# Altium schematic sheet FPGA_SDRAM.SchDoc
size 420 x 297 mm; EDA_Number: ARTIQ; CompanyName: WUT ISE; Organization: WUT ISE; DocumentNumber: 14; SheetNumber: 5; ModifiedBy: -; Title2: FPGA SDRAM; ModifiedDate: -
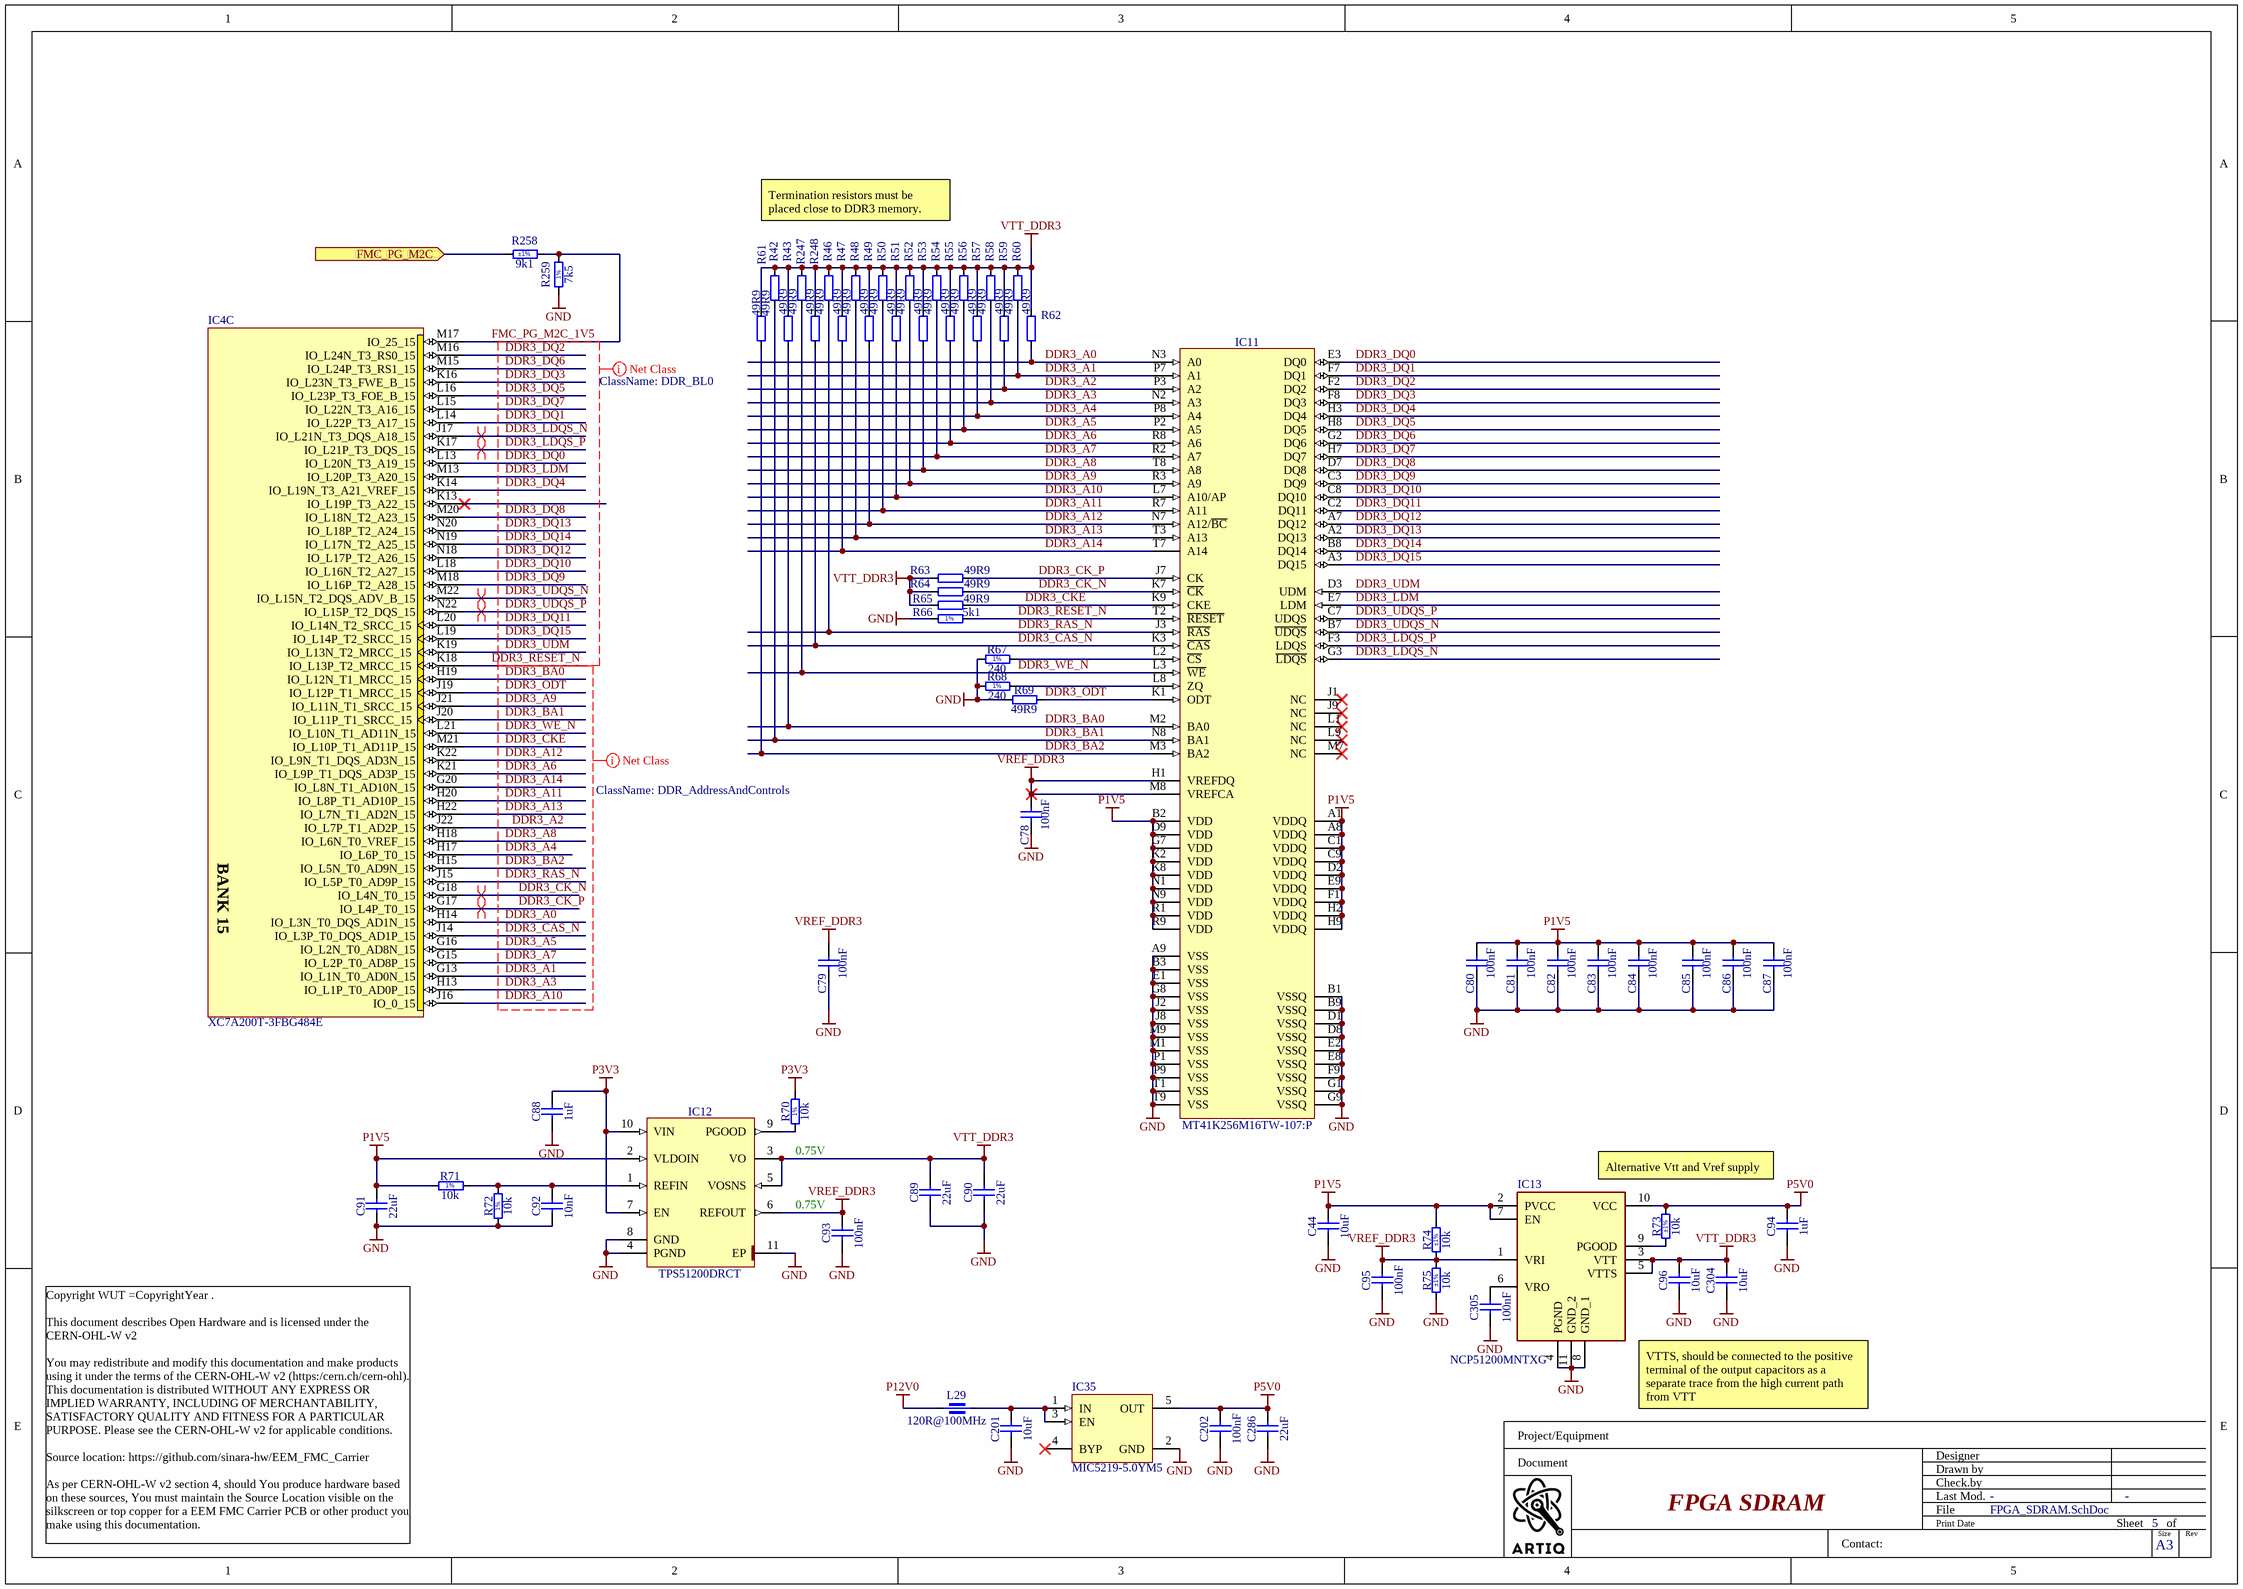
[diagram p0: FPGA_SDRAM.SchDoc]

## Parts
C44  10uF  [CAPC2012X95N]
C78  100nF  [CAPC0603X33N]
C79  100nF  [CAPC0603X33N]
C80  100nF  [CAPC0603X33N]
C81  100nF  [CAPC0603X33N]
C82  100nF  [CAPC0603X33N]
C83  100nF  [CAPC0603X33N]
C84  100nF  [CAPC0603X33N]
C85  100nF  [CAPC0603X33N]
C86  100nF  [CAPC0603X33N]
C87  100nF  [CAPC0603X33N]
C88  1uF  [CAPC1005X55N]
C89  22uF  [CAPC1608X90N]
C90  22uF  [CAPC1608X90N]
C91  22uF  [CAPC1608X90N]
C92  10nF  [CAPC1005X55N]
C93  100nF  [CAPC0603X33N]
C94  1uF  [CAPC1608X87N]
C95  100nF  [CAPC0603X33N]
C96  10uF  [CAPC2012X95N]
C201  10uF  [CAPC2012X95N]
C202  100nF  [CAPC0603X33N]
C286  22uF  [CAPC1608X90N]
C304  10uF  [CAPC2012X95N]
C305  100nF  [CAPC0603X33N]
IC4  XC7A200T-3FBG484E  [BGA484C100P22X22_2300X2300X254]  (part C of 10)
IC11  MT41K256M16TW-107:P  [BGA96C80P9X16_800X1400X120]
IC12  TPS51200DRCT  [TEXAS_DRC (S-PVSON-N10)]
IC13  NCP51200MNTXG  [SON50P300X300X100-11N]
IC35  MIC5219-5.0YM5  [SOT95P280X145-5N]
L29  120R@100MHz  [INDC1608X65N]
R42  49R9  [RESC1005X40N]
R43  49R9  [RESC1005X40N]
R46  49R9  [RESC1005X40N]
R47  49R9  [RESC1005X40N]
R48  49R9  [RESC1005X40N]
R49  49R9  [RESC1005X40N]
R50  49R9  [RESC1005X40N]
R51  49R9  [RESC1005X40N]
R52  49R9  [RESC1005X40N]
R53  49R9  [RESC1005X40N]
R54  49R9  [RESC1005X40N]
R55  49R9  [RESC1005X40N]
R56  49R9  [RESC1005X40N]
R57  49R9  [RESC1005X40N]
R58  49R9  [RESC1005X40N]
R59  49R9  [RESC1005X40N]
R60  49R9  [RESC1005X40N]
R61  49R9  [RESC1005X40N]
R62  49R9  [RESC1005X40N]
R63  49R9  [RESC1005X40N]
R64  49R9  [RESC1005X40N]
R65  49R9  [RESC1005X40N]
R66  5k1  [RESC1005X40N]
R67  240  [RESC1005X40N]
R68  240  [RESC1005X40N]
R69  49R9  [RESC1005X40N]
R70  10k  [RESC1005X40N]
R71  10k  [RESC1005X40N]
R72  10k  [RESC1005X40N]
R73  10k  Tolerance: ±1%  [RESC1005X40N]
R74  10k  Tolerance: ±1%  [RESC1005X40N]
R75  10k  Tolerance: ±1%  [RESC1005X40N]
R247  49R9  [RESC1005X40N]
R248  49R9  [RESC1005X40N]
R258  9k1  Tolerance: ±1%  [RESC1005X40N]
R259  7k5  [RESC1005X40N]

## Ports
FMC_PG_M2C (in)

## Nets
GND: C44.1 C78.1 C79.1 C80.1 C81.1 C82.1 C83.1 C84.1 C85.1 C86.1 C87.1 C88.1 C89.1 C90.1 C91.1 C92.1 C93.1 C94.1 C95.1 C96.1 C201.1 C202.1 C286.1 C304.1 C305.1 IC11.A9(VSS) IC11.B1(VSSQ) IC11.B3(VSS) IC11.B9(VSSQ) IC11.D1(VSSQ) IC11.D8(VSSQ) IC11.E1(VSS) IC11.E2(VSSQ) IC11.E8(VSSQ) IC11.F9(VSSQ) IC11.G1(VSSQ) IC11.G8(VSS) IC11.G9(VSSQ) IC11.J2(VSS) IC11.J8(VSS) IC11.M1(VSS) IC11.M9(VSS) IC11.P1(VSS) IC11.P9(VSS) IC11.T1(VSS) IC11.T9(VSS) IC12.4(PGND) IC12.8(GND) IC12.11(EP) IC13.4(PGND) IC13.8(GND_1) IC13.11(GND_2) IC35.2(GND) R66.1 R67.1 R68.1 R69.1 R72.1 R75.1 R259.1
P1V5: C44.2 C80.2 C81.2 C82.2 C83.2 C84.2 C85.2 C86.2 C87.2 C91.2 IC11.A1(VDDQ) IC11.A8(VDDQ) IC11.B2(VDD) IC11.C1(VDDQ) IC11.C9(VDDQ) IC11.D2(VDDQ) IC11.D9(VDD) IC11.E9(VDDQ) IC11.F1(VDDQ) IC11.G7(VDD) IC11.H2(VDDQ) IC11.H9(VDDQ) IC11.K2(VDD) IC11.K8(VDD) IC11.N1(VDD) IC11.N9(VDD) IC11.R1(VDD) IC11.R9(VDD) IC12.2(VLDOIN) IC13.2(PVCC) IC13.7(EN) R71.1 R74.2
P3V3: C88.2 IC12.7(EN) IC12.10(VIN) R70.2
P5V0: C94.2 C202.2 C286.2 IC13.10(VCC) IC35.5(OUT) R73.2
P12V0: L29.1
VREF_DDR3: C78.2 C79.2 C93.2 C95.2 IC11.H1(VREFDQ) IC11.M8(VREFCA) IC12.6(REFOUT) IC13.1(VRI) R74.1 R75.2
VTT_DDR3: C89.2 C90.2 C96.2 C304.2 IC12.3(VO) IC12.5(VOSNS) IC13.3(VTT) IC13.5(VTTS) R42.2 R43.2 R46.2 R47.2 R48.2 R49.2 R50.2 R51.2 R52.2 R53.2 R54.2 R55.2 R56.2 R57.2 R58.2 R59.2 R60.2 R61.2 R62.2 R63.1 R64.1 R65.1 R247.2 R248.2
DDR3_A0: IC4.H14(IO_L3N_T0_DQS_AD1N_15) IC11.N3(A0) R62.1
DDR3_A1: IC4.G13(IO_L1N_T0_AD0N_15) IC11.P7(A1) R60.1
DDR3_A2: IC4.J22(IO_L7P_T1_AD2P_15) IC11.P3(A2) R59.1
DDR3_A3: IC4.H13(IO_L1P_T0_AD0P_15) IC11.N2(A3) R58.1
DDR3_A4: IC4.H17(IO_L6P_T0_15) IC11.P8(A4) R57.1
DDR3_A5: IC4.G16(IO_L2N_T0_AD8N_15) IC11.P2(A5) R56.1
DDR3_A6: IC4.K21(IO_L9P_T1_DQS_AD3P_15) IC11.R8(A6) R55.1
DDR3_A7: IC4.G15(IO_L2P_T0_AD8P_15) IC11.R2(A7) R54.1
DDR3_A8: IC4.H18(IO_L6N_T0_VREF_15) IC11.T8(A8) R53.1
DDR3_A9: IC4.J21(IO_L11N_T1_SRCC_15) IC11.R3(A9) R52.1
DDR3_A10: IC4.J16(IO_0_15) IC11.L7(A10/AP) R51.1
DDR3_A11: IC4.H20(IO_L8P_T1_AD10P_15) IC11.R7(A11) R50.1
DDR3_A12: IC4.K22(IO_L9N_T1_DQS_AD3N_15) IC11.N7(A12/~{BC}) R49.1
DDR3_A13: IC4.H22(IO_L7N_T1_AD2N_15) IC11.T3(A13) R48.1
DDR3_A14: IC4.G20(IO_L8N_T1_AD10N_15) IC11.T7(A14) R47.1
DDR3_BA0: IC4.H19(IO_L12N_T1_MRCC_15) IC11.M2(BA0) R43.1
DDR3_BA1: IC4.J20(IO_L11P_T1_SRCC_15) IC11.N8(BA1) R42.1
DDR3_BA2: IC4.H15(IO_L5N_T0_AD9N_15) IC11.M3(BA2) R61.1
DDR3_CAS_N: IC4.J14(IO_L3P_T0_DQS_AD1P_15) IC11.K3(~{CAS}) R248.1
DDR3_CK_N: IC4.G18(IO_L4N_T0_15) IC11.K7(~{CK}) R64.2
DDR3_CK_P: IC4.G17(IO_L4P_T0_15) IC11.J7(CK) R63.2
DDR3_CKE: IC4.M21(IO_L10P_T1_AD11P_15) IC11.K9(CKE) R65.2
DDR3_DQ0: IC4.L13(IO_L20N_T3_A19_15) IC11.E3(DQ0)
DDR3_DQ1: IC4.L14(IO_L22P_T3_A17_15) IC11.F7(DQ1)
DDR3_DQ2: IC4.M16(IO_L24N_T3_RS0_15) IC11.F2(DQ2)
DDR3_DQ3: IC4.K16(IO_L23N_T3_FWE_B_15) IC11.F8(DQ3)
DDR3_DQ4: IC4.K14(IO_L19N_T3_A21_VREF_15) IC11.H3(DQ4)
DDR3_DQ5: IC4.L16(IO_L23P_T3_FOE_B_15) IC11.H8(DQ5)
DDR3_DQ6: IC4.M15(IO_L24P_T3_RS1_15) IC11.G2(DQ6)
DDR3_DQ7: IC4.L15(IO_L22N_T3_A16_15) IC11.H7(DQ7)
DDR3_DQ8: IC4.M20(IO_L18N_T2_A23_15) IC11.D7(DQ8)
DDR3_DQ9: IC4.M18(IO_L16P_T2_A28_15) IC11.C3(DQ9)
DDR3_DQ10: IC4.L18(IO_L16N_T2_A27_15) IC11.C8(DQ10)
DDR3_DQ11: IC4.L20(IO_L14N_T2_SRCC_15) IC11.C2(DQ11)
DDR3_DQ12: IC4.N18(IO_L17P_T2_A26_15) IC11.A7(DQ12)
DDR3_DQ13: IC4.N20(IO_L18P_T2_A24_15) IC11.A2(DQ13)
DDR3_DQ14: IC4.N19(IO_L17N_T2_A25_15) IC11.B8(DQ14)
DDR3_DQ15: IC4.L19(IO_L14P_T2_SRCC_15) IC11.A3(DQ15)
DDR3_LDM: IC4.M13(IO_L20P_T3_A20_15) IC11.E7(LDM)
DDR3_LDQS_N: IC4.J17(IO_L21N_T3_DQS_A18_15) IC11.G3(~{LDQS})
DDR3_LDQS_P: IC4.K17(IO_L21P_T3_DQS_15) IC11.F3(LDQS)
DDR3_ODT: IC4.J19(IO_L12P_T1_MRCC_15) IC11.K1(ODT) R69.2
DDR3_RAS_N: IC4.J15(IO_L5P_T0_AD9P_15) IC11.J3(~{RAS}) R46.1
DDR3_RESET_N: IC4.K18(IO_L13P_T2_MRCC_15) IC11.T2(~{RESET}) R66.2
DDR3_UDM: IC4.K19(IO_L13N_T2_MRCC_15) IC11.D3(UDM)
DDR3_UDQS_N: IC4.M22(IO_L15N_T2_DQS_ADV_B_15) IC11.B7(~{UDQS})
DDR3_UDQS_P: IC4.N22(IO_L15P_T2_DQS_15) IC11.C7(UDQS)
DDR3_WE_N: IC4.L21(IO_L10N_T1_AD11N_15) IC11.L3(~{WE}) R247.1
FMC_PG_M2C: R258.1 ; port FMC_PG_M2C
FMC_PG_M2C_1V5: IC4.M17(IO_25_15) R258.2 R259.2
NetC92_2: C92.2 IC12.1(REFIN) R71.2 R72.2
NetC201_2: C201.2 IC35.1(IN) IC35.3(EN) L29.2
NetC305_2: C305.2 IC13.6(VRO)
NetIC11_L2: IC11.L2(~{CS}) R67.2
NetIC11_L8: IC11.L8(ZQ) R68.2
NetIC12_9: IC12.9(PGOOD) R70.1
NetIC13_9: IC13.9(PGOOD) R73.1

Not connected (* = marked no-connect by the designer): IC4 K13(IO_L19P_T3_A22_15)*; IC11 J1(NC)* J9(NC)* L1(NC)* L9(NC)* M7(NC)*; IC35 4(BYP)*

## Layout directives
differential pair; differential pair class Diff_100Ohm; differential pair class Diff_100Ohm: DDR3_CK_N, DDR3_CK_P
differential pair; differential pair class Diff_100Ohm: DDR3_LDQS_N, DDR3_LDQS_P, DDR3_UDQS_N, DDR3_UDQS_P
net class DDR_AddressAndControls; net class 50Ohm: DDR3_A0, DDR3_A1, DDR3_A2, DDR3_A3, DDR3_A4, DDR3_A5, DDR3_A6, DDR3_A7, DDR3_A8, DDR3_A9, DDR3_A10, DDR3_A11, DDR3_A12, DDR3_A13, DDR3_A14, DDR3_BA0, DDR3_BA1, DDR3_BA2, DDR3_CAS_N, DDR3_CK_N, DDR3_CK_P, DDR3_CKE, DDR3_ODT, DDR3_RAS_N, DDR3_WE_N
net class DDR_BL0; net class 50Ohm: DDR3_DQ0, DDR3_DQ1, DDR3_DQ2, DDR3_DQ3, DDR3_DQ4, DDR3_DQ5, DDR3_DQ6, DDR3_DQ7, DDR3_DQ8, DDR3_DQ9, DDR3_DQ10, DDR3_DQ11, DDR3_DQ12, DDR3_DQ13, DDR3_DQ14, DDR3_DQ15, DDR3_LDM, DDR3_LDQS_N, DDR3_LDQS_P, DDR3_UDM, DDR3_UDQS_N, DDR3_UDQS_P

## Notes on the sheet
- Termination resistors must be placed close to DDR3 memory.
- (near R70) 0.75V
- (near C93) 0.75V
- Alternative Vtt and Vref supply
- (near IC13) VTTS, should be connected to the positive terminal of the output capacitors as a separate trace from the high current path from VTT
- Project/Equipment
- Document
- Designer
- Drawn by
- Check.by
- Copyright WUT =CopyrightYear .
  This document describes Open Hardware and is licensed under the CERN-OHL-W v2
  You may redistribute and modify this documentation and make products using it under the terms of the CERN-OHL-W v2 (https:/cern.ch/cern-ohl). This documentation is distributed WITHOUT ANY EXPRESS OR IMPLIED WARRANTY, INCLUDING OF MERCHANTABILITY, SATISFACTORY QUALITY AND FITNESS FOR A PARTICULAR PURPOSE. Please see the CERN-OHL-W v2 for applicable conditions.
  Source location: https://github.com/sinara-hw/EEM_FMC_Carrier
  As per CERN-OHL-W v2 section 4, should You produce hardware based on these sources, You must maintain the Source Location visible on the silkscreen or top copper for a EEM FMC Carrier PCB or other product you make using this documentation.
- Contact:
- File
- Last Mod.
- Print Date
- Sheet
- Size
- A3
- of
- Rev
- (in symbol R0402_5K1_1%_0.0625W_100PPM) 1%
- (in symbol R0402_7K5_1%_0.0625W_100PPM) 1%
- (in symbol R0402_10K_1%_0.0625W_100PPM) 1%
- (in symbol R0402_240R_1%_0.0625W_100PPM) 1%
- (in symbol XC7A200T-3FBG484E, part C) BANK 15

## Library data of the parts
C44 C96 C201 C304 = CC0805_10UF_25V_10%_X5R: Non-polarised capacitor; Part Description: SMD Multilayer Chip Ceramic Capacitor; Manufacturer: GENERIC; Manufacturer1 Part Number: GRM219R61E106KA12D; Voltage: 25V; TC: X5R; Tolerance: ±10%; Part Number: CC0805_10UF_25V_10%_X5R; Component Kind: Standard; Component Type: Standard; Pin Count: 2; Value: 10uF; Status: Preferred; Manufacturer Part Number: CC0805_10UF_25V_10%_X5R; Case: 0805; Mounted: Yes; Socket: No; SMD: Yes; Sense: No; Manufacturer1 Example: MURATA; Manufacturer1 ComponentHeight: 0.95mm; HelpURL: \\cern.ch\dfs\Applications\Altium\Datasheets\CC0805_X5R_MURATA_GRM.pdf; Author: CERN DEM JLC; CreateDate: 25.10.2012; LatestRevisionDate: 06.09.2016
C78-C87 C93 C95 C202 C305 = CC0201_100NF_6.3V_10%_X5R: Non-polarised capacitor; Part Description: SMD Multilayer Chip Ceramic Capacitor; Manufacturer: GENERIC; Manufacturer1 Part Number: 02016D104KAT2A; Voltage: 6.3V; TC: X5R; Tolerance: ±10%; Part Number: CC0201_100NF_6.3V_10%_X5R; Component Kind: Standard; Component Type: Standard; Pin Count: 2; Value: 100nF; Status: Not Recommended; Manufacturer Part Number: CC0201_100NF_6.3V_10%_X5R; Case: 0201; Mounted: Yes; Socket: No; SMD: Yes; Sense: No; Manufacturer1 Example: AVX; Manufacturer1 ComponentHeight: 0.33mm; HelpURL: \\cern.ch\dfs\Applications\Altium\Datasheets\CC0201_X5R_AVX.pdf; Author: CERN DEM JLC
  C78-C87: CreateDate: 2007-12-03; LatestRevisionDate: 2007-12-03
  C93 C95 C202 C305: CreateDate: 03.12.2007; LatestRevisionDate: 03.12.2007
C88 = CC0402_1UF_16V_10%_X5R: Non-polarised capacitor; Part Description: SMD Multilayer Chip Ceramic Capacitor; Manufacturer: GENERIC; Manufacturer1 Part Number: C1005X5R1C105KT; Voltage: 16V; TC: X5R; Tolerance: ±10%; Part Number: CC0402_1UF_16V_10%_X5R; Component Kind: Standard; Component Type: Standard; Pin Count: 2; Value: 1uF; Status: Preferred; Manufacturer Part Number: CC0402_1UF_16V_10%_X5R; Case: 0402; Mounted: Yes; Socket: No; SMD: Yes; Manufacturer1 Example: TDK; Manufacturer1 ComponentHeight: 0.55mm; HelpURL: \\cern.ch\dfs\Applications\Altium\Datasheets\CC0402_X5R_TDK_C.pdf; Author: CERN DEM JLC; CreateDate: 25.10.2012; LatestRevisionDate: 25.10.2012; Sense: No
C89-C91 C286 = CC0603_22UF_6.3V_20%_X5R: Non-polarised capacitor; Part Description: SMD Multilayer Chip Ceramic Capacitor; Manufacturer: GENERIC; Manufacturer1 Part Number: C1608X5R0J226M080; Voltage: 6.3V; TC: X5R; Tolerance: ±20%; Part Number: CC0603_22UF_6.3V_20%_X5R; Component Kind: Standard; Component Type: Standard; Pin Count: 2; Value: 22uF; Status: None; Manufacturer Part Number: CC0603_22UF_6.3V_20%_X5R; Case: 0603; Mounted: Yes; Socket: No; SMD: Yes; Manufacturer1 Example: TDK; Manufacturer1 ComponentHeight: 0.9mm; HelpURL: \\cern.ch\dfs\Applications\Altium\Datasheets\CC0603_X5R_TDK_C.pdf; Author: CERN DEM JLC; CreateDate: 16.12.2013; LatestRevisionDate: 03.12.2020; Sense: No
C92 = CC0402_10NF_16V_10%_X7R: Non-polarised capacitor; Part Description: SMD Multilayer Chip Ceramic Capacitor; Manufacturer: GENERIC; Manufacturer1 Part Number: 223878715636; Voltage: 16V; TC: X7R; Tolerance: ±10%; Part Number: CC0402_10NF_16V_10%_X7R; Component Kind: Standard; Component Type: Standard; Pin Count: 2; Value: 10nF; Status: Not Recommended; Manufacturer Part Number: CC0402_10NF_16V_10%_X7R; Case: 0402; Mounted: Yes; Socket: No; SMD: Yes; Manufacturer1 Example: PHYCOMP; Manufacturer1 ComponentHeight: 0.55mm; HelpURL: \\cern.ch\dfs\Applications\Altium\Datasheets\CC0402_X7R_PHYCOMP.pdf; Author: CERN DEM JLC; CreateDate: 03.12.2007; LatestRevisionDate: 03.12.2007; Sense: No
C94 = CC0603_1UF_25V_10%_X7R: Non-polarised capacitor; Part Description: SMD Multilayer Chip Ceramic Capacitor; Manufacturer: GENERIC; Manufacturer1 Part Number: GRM188R71E105KA12D; Voltage: 25V; TC: X7R; Tolerance: ±10%; Part Number: CC0603_1UF_25V_10%_X7R; Component Kind: Standard; Component Type: Standard; Pin Count: 2; Value: 1uF; Status: None; Manufacturer Part Number: CC0603_1UF_25V_10%_X7R; Case: 0603; Mounted: Yes; Socket: No; SMD: Yes; Sense: No; Manufacturer1 Example: MURATA; Manufacturer1 ComponentHeight: 0.9mm; HelpURL: \\cern.ch\dfs\Applications\Altium\Datasheets\CC0603_X7R_MURATA.pdf; Author: CERN DEM JLC; CreateDate: 18.01.2011; LatestRevisionDate: 18.01.2011
IC4 = XC7A200T-3FBG484E: Artix-7 FPGA, 285 User I/Os, 4 GTP, 484-Ball BGA, Pb-Free; Manufacturer Part Number: XC7A200T-3FBG484E; Device: XC7A200T-3FBG484E
IC11 = MT41K256M16TW-107:P: 32 Meg x 16 x 8 Banks DDR3L SDRAM; Part Description: +1.5V, 4Gb (32Meg x 16 x 8 banks) DDR3L SDRAM; Manufacturer: MICRON TECHNOLOGY; PressFit: No; Bonding: No; Part Number: MT41K256M16TW-107:P; Component Kind: Standard; Component Type: Standard; Device: MT41K256M16TW-107:P; PackageDescription: BGA 0.8mm, Pitch, Square 96 Pin, 9 Columns x 16 Rows, Body 14mm X 8mm X 1.2mm H; Manufacturer Part Number: MT41K256M16TW-107:P; Pin Count: 96; Case: BGA96; Mounted: Yes; Socket: No; SMD: Yes; Sense: No; ComponentHeight: 1.2mm; HelpURL: \\cern.ch\dfs\Applications\Altium\Datasheets\MT41K256M16TW-107-P.pdf; Author: CERN DEM MR; CreateDate: 2015-12-14; LatestRevisionDate: 2015-12-14
IC12 = TPS51200DRCT: Sink/Source DDR Termination Regulator; Part Description: 3.3V Sink/Source DDR Termination Regulator; Manufacturer: TEXAS INSTRUMENTS; PressFit: No; Bonding: No; Part Number: TPS51200DRCT; Component Kind: Standard; Component Type: Standard; Device: TPS51200DRCT; PackageDescription: SON, 0.50mm Pitch, 10-pin, 3.00mm W  X 3.00mm L X 1.00mm Height, (w/thermal tab 1.75 X 2.50 mm); Manufacturer Part Number: TPS51200DRCT; Pin Count: 11; Case: SON10; Mounted: Yes; Socket: No; SMD: Yes; Sense: No; ComponentHeight: 1mm; HelpURL: \\cern.ch\dfs\Applications\Altium\Datasheets\TPS51200DRCT.pdf; Author: CERN DEM JLC; CreateDate: 03.02.2010; LatestRevisionDate: 06.11.2013
IC13 = NCP51200MNTXG: Integrated Circuit; Manufacturer_Name: onsemi; Datasheet Link: http://www.onsemi.com/pub/Collateral/NCP51200-D.PDF; Height: 1mm; Mouser Part Number: 863-NCP51200MNTXG; Mouser Price/Stock: https://www.mouser.co.uk/ProductDetail/onsemi/NCP51200MNTXG?qs=mt7EBqA2jzgnxcGILBvARw%3D%3D; Arrow Part Number: NCP51200MNTXG; Arrow Price/Stock: https://www.arrow.com/en/products/ncp51200mntxg/on-semiconductor?region=nac; Manufacturer Part Number: NCP51200MNTXG
IC35 = MIC5219-5.0YM5: 500mA-Peak Output LDO Regulator 5.0V; Manufacturer: Microchip; Manufacturer Part Number: MIC5219-5.0YM5; Device: MIC5219-5.0YM5
L29 = IND0603_MURATA_BLM18SG121TN1D: Part Description: SMD EMIFIL Suppression Chip Ferrite Bead; Manufacturer: MURATA; Power: 3A; Resistance: 0.025R; Tolerance: ±25%; Part Number: IND0603_MURATA_BLM18SG121TN1D; Component Kind: Standard; Component Type: Standard; Pin Count: 2; Value: 120R@100MHz; Status: None; Manufacturer Part Number: BLM18SG121TN1D; Case: 0603; Mounted: Yes; Socket: No; SMD: Yes; Sense: No; ComponentHeight: 0.65mm; HelpURL: \\cern.ch\dfs\Applications\Altium\Datasheets\IND0603_MURATA_BLM18S.pdf; Author: CERN DEM JLC; CreateDate: 23.07.2014; LatestRevisionDate: 25.10.2018
R42 R43 R46-R65 R69 R247 R248 = R0402_49R9_1%_0.0625W_100PPM: Resistor - 1%; Part Description: General Purpose Thick Film Chip Resistor; Manufacturer: GENERIC; Manufacturer1 Part Number: 232270674999L or RC0402FR-0749R9L; TC: ±100ppm/°C; PressFit: No; Part Number: R0402_49R9_1%_0.0625W_100PPM; Component Kind: Standard; Component Type: Standard; Pin Count: 2; Value: 49R9; Status: Not Recommended; Power: 0.0625W; Tolerance: ±1%; Manufacturer Part Number: R0402_49R9_1%_0.0625W_100PPM; Case: 0402; Mounted: Yes; Socket: No; SMD: Yes; Manufacturer1 Example: YAGEO PHYCOMP; Manufacturer1 ComponentHeight: 0.4mm; HelpURL: \\cern.ch\dfs\Applications\Altium\Datasheets\R0402_Phycomp_RC0402.pdf; Author: CERN DEM JLC; CreateDate: 24.10.2012; LatestRevisionDate: 24.10.2012; Sense: No
R66 = R0402_5K1_1%_0.0625W_100PPM: Resistor - 1%; Part Description: General Purpose Thick Film Chip Resistor; Manufacturer: GENERIC; Manufacturer1 Part Number: 232270675102L; TC: ±100ppm/°C; PressFit: No; Part Number: R0402_5K1_1%_0.0625W_100PPM; Component Kind: Standard; Component Type: Standard; Pin Count: 2; Value: 5k1; Status: Not Recommended; Power: 0.0625W; Tolerance: ±1%; Manufacturer Part Number: R0402_5K1_1%_0.0625W_100PPM; Case: 0402; Mounted: Yes; Sense: No; Socket: No; SMD: Yes; Manufacturer1 Example: YAGEO PHYCOMP; Manufacturer1 ComponentHeight: 0.4mm; HelpURL: \\cern.ch\dfs\Applications\Altium\Datasheets\R0402_Phycomp_RC0402.pdf; Author: CERN DEM JLC; CreateDate: 03.12.2007; LatestRevisionDate: 17.10.2012
R67 R68 = R0402_240R_1%_0.0625W_100PPM: Resistor - 1%; Part Description: General Purpose Thick Film Chip Resistor; Manufacturer: GENERIC; Manufacturer1 Part Number: 232270672401L; TC: ±100ppm/°C; PressFit: No; Part Number: R0402_240R_1%_0.0625W_100PPM; Component Kind: Standard; Component Type: Standard; Pin Count: 2; Value: 240; Status: Not Recommended; Power: 0.0625W; Tolerance: ±1%; Manufacturer Part Number: R0402_240R_1%_0.0625W_100PPM; Case: 0402; Mounted: Yes; Sense: No; Socket: No; SMD: Yes; Manufacturer1 Example: YAGEO PHYCOMP; Manufacturer1 ComponentHeight: 0.4mm; HelpURL: \\cern.ch\dfs\Applications\Altium\Datasheets\R0402_Phycomp_RC0402.pdf; Author: CERN DEM JLC; CreateDate: 03.12.2007; LatestRevisionDate: 17.10.2012
R70-R75 = R0402_10K_1%_0.0625W_100PPM: Resistor - 1%; Part Description: General Purpose Thick Film Chip Resistor; Manufacturer: GENERIC; Manufacturer1 Part Number: 232270671003L; TC: ±100ppm/°C; PressFit: No; Part Number: R0402_10K_1%_0.0625W_100PPM; Component Kind: Standard; Component Type: Standard; Pin Count: 2; Value: 10k; Status: Not Recommended; Power: 0.0625W; Manufacturer Part Number: R0402_10K_1%_0.0625W_100PPM; Case: 0402; Mounted: Yes; Socket: No; SMD: Yes; Manufacturer1 Example: YAGEO PHYCOMP; Manufacturer1 ComponentHeight: 0.4mm; HelpURL: \\cern.ch\dfs\Applications\Altium\Datasheets\R0402_Phycomp_RC0402.pdf; Author: CERN DEM JLC; CreateDate: 03.12.2007; LatestRevisionDate: 17.10.2012; Sense: No
  R70-R72: Tolerance: ±1%
R258 = R0402_9K1_1%_0.0625W_100PPM: Resistor - 1%; Part Description: General Purpose Thick Film Chip Resistor; Manufacturer: GENERIC; Manufacturer1 Part Number: 232270679102L; TC: ±100ppm/°C; PressFit: No; Part Number: R0402_9K1_1%_0.0625W_100PPM; Component Kind: Standard; Component Type: Standard; Pin Count: 2; Value: 9k1; Status: Not Recommended; Power: 0.0625W; Manufacturer Part Number: R0402_9K1_1%_0.0625W_100PPM; Case: 0402; Mounted: Yes; Sense: No; Socket: No; SMD: Yes; Manufacturer1 Example: YAGEO PHYCOMP; Manufacturer1 ComponentHeight: 0.4mm; HelpURL: \\cern.ch\dfs\Applications\Altium\Datasheets\R0402_Phycomp_RC0402.pdf; Author: CERN DEM JLC; CreateDate: 2007-12-03; LatestRevisionDate: 2012-10-17
R259 = R0402_7K5_1%_0.0625W_100PPM: Resistor - 1%; Part Description: General Purpose Thick Film Chip Resistor; Manufacturer: GENERIC; Manufacturer1 Part Number: 232270677502L; TC: ±100ppm/°C; PressFit: No; Part Number: R0402_7K5_1%_0.0625W_100PPM; Component Kind: Standard; Component Type: Standard; Pin Count: 2; Value: 7k5; Status: Not Recommended; Power: 0.0625W; Tolerance: ±1%; Manufacturer Part Number: R0402_7K5_1%_0.0625W_100PPM; Case: 0402; Mounted: Yes; Sense: No; Socket: No; SMD: Yes; Manufacturer1 Example: YAGEO PHYCOMP; Manufacturer1 ComponentHeight: 0.4mm; HelpURL: \\cern.ch\dfs\Applications\Altium\Datasheets\R0402_Phycomp_RC0402.pdf; Author: CERN DEM JLC; CreateDate: 03.12.2007; LatestRevisionDate: 17.10.2012